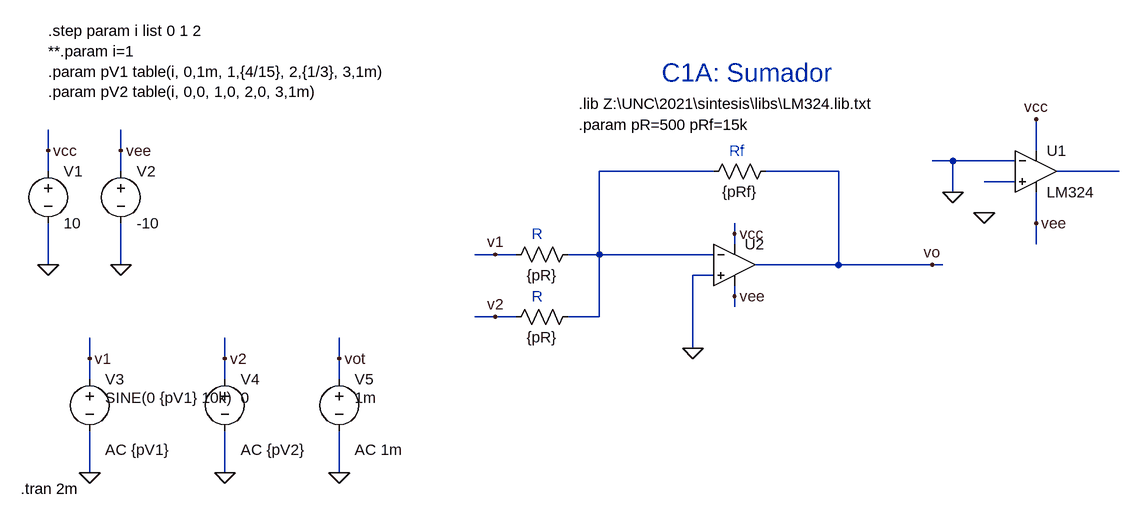
[diagram p0: schematic c1ASumador.asc]
c1ASumador.asc, the LTspice schematic file:
Version 4
SHEET 1 1432 680
WIRE -816 0 -816 -32
WIRE -704 0 -704 -32
WIRE 704 0 704 -48
WIRE 576 16 544 16
WIRE 672 16 576 16
WIRE -816 32 -816 0
WIRE -704 32 -704 0
WIRE 208 32 32 32
WIRE 400 32 288 32
WIRE 832 32 736 32
WIRE 672 48 624 48
WIRE 576 64 576 16
WIRE 704 112 704 64
WIRE 240 128 240 112
WIRE 240 144 240 128
WIRE 704 144 704 112
WIRE -128 160 -160 160
WIRE -96 160 -128 160
WIRE 32 160 32 32
WIRE 32 160 -16 160
WIRE 208 160 32 160
WIRE -816 176 -816 112
WIRE -704 176 -704 112
WIRE 400 176 400 32
WIRE 400 176 272 176
WIRE 544 176 400 176
WIRE 560 176 544 176
WIRE 208 192 176 192
WIRE 240 224 240 208
WIRE 240 240 240 224
WIRE -128 256 -160 256
WIRE -96 256 -128 256
WIRE 32 256 32 160
WIRE 32 256 -16 256
WIRE 176 304 176 192
WIRE -752 320 -752 288
WIRE -544 320 -544 288
WIRE -368 320 -368 288
WIRE -752 352 -752 320
WIRE -544 352 -544 320
WIRE -368 352 -368 320
WIRE -752 496 -752 432
WIRE -544 496 -544 432
WIRE -368 496 -368 432
FLAG 176 304 0
FLAG 240 128 vcc
FLAG 240 224 vee
FLAG -816 176 0
FLAG -816 0 vcc
FLAG -704 176 0
FLAG -704 0 vee
FLAG -752 496 0
FLAG -752 320 v1
FLAG -544 496 0
FLAG -544 320 v2
FLAG 544 176 vo
FLAG -368 496 0
FLAG -368 320 vot
FLAG 704 -48 vcc
FLAG 704 112 vee
FLAG 624 96 0
FLAG -128 160 v1
FLAG 576 64 0
FLAG -128 256 v2
DATAFLAG 496 176 ""
SYMBOL res 0 144 R90
WINDOW 0 0 56 Invisible 2
WINDOW 3 32 56 VTop 2
SYMATTR InstName R1
SYMATTR Value {pR}
SYMBOL voltage -816 16 R0
WINDOW 123 0 0 Left 0
WINDOW 39 0 0 Left 0
SYMATTR InstName V1
SYMATTR Value 10
SYMBOL voltage -704 16 R0
WINDOW 123 0 0 Left 0
WINDOW 39 0 0 Left 0
SYMATTR InstName V2
SYMATTR Value -10
SYMBOL voltage -752 336 R0
WINDOW 123 24 124 Left 2
WINDOW 39 24 44 Left 2
WINDOW 3 24 44 Left 2
SYMATTR Value2 AC {pV1}
SYMATTR Value SINE(0 {pV1} 10k)
SYMATTR InstName V3
SYMBOL voltage -544 336 R0
WINDOW 123 24 124 Left 2
WINDOW 39 0 0 Left 0
WINDOW 3 24 44 Left 2
SYMATTR Value2 AC {pV2}
SYMATTR Value 0
SYMATTR InstName V4
SYMBOL res 0 240 R90
WINDOW 0 0 56 Invisible 2
WINDOW 3 32 56 VTop 2
SYMATTR InstName R2
SYMATTR Value {pR}
SYMBOL res 304 16 R90
WINDOW 0 0 56 Invisible 2
WINDOW 3 32 56 VTop 2
SYMATTR InstName R3
SYMATTR Value {pRf}
SYMBOL OpAmps\\UniversalOpamp2 240 176 R0
SYMATTR InstName U2
SYMATTR Value2 Avol=100k GBW=1Meg Slew=.5Meg
SYMATTR SpiceLine2 en=0 enk=0 in=0 ink=0 Rin=500Meg
SYMBOL voltage -368 336 R0
WINDOW 123 24 124 Left 2
WINDOW 39 24 44 Left 2
WINDOW 3 24 44 Left 2
SYMATTR Value2 AC 1m
SYMATTR Value 1m
SYMATTR InstName V5
SYMBOL OpAmps\\opamp2 704 -32 R0
SYMATTR InstName U1
SYMATTR Value LM324
TEXT 0 -40 Left 2 !.param pR=500 pRf=15k
TEXT 0 -72 Left 2 !.lib Z:\\UNC\\2021\\sintesis\\libs\\LM324.lib.txt
TEXT -816 -184 Left 2 !.step param i list 0 1 2\n**.param i=1\n.param pV1 table(i, 0,1m, 1,{4/15}, 2,{1/3}, 3,1m)\n.param pV2 table(i, 0,0, 1,0, 2,0, 3,1m)
TEXT 128 -120 Left 4 ;C1A: Sumador
TEXT -72 224 Left 2 ;R
TEXT -72 128 Left 2 ;R
TEXT 232 0 Left 2 ;Rf
TEXT -858 520 Left 2 !.tran 2m

The netlist it stands for:
* c1ASumador.asc
R1 N001 v1 {pR}
V1 vcc 0 10
V2 vee 0 -10
V3 v1 0 SINE(0 {pV1} 10k) AC {pV1}
V4 v2 0 0 AC {pV2}
R2 N001 v2 {pR}
R3 vo N001 {pRf}
XU2 0 N001 vcc vee vo level.2 Avol=100k GBW=1Meg Slew=.5Meg ilimit=25m rail=0 Vos=0 phimargin=45 en=0 enk=0 in=0 ink=0 Rin=500Meg  ; pins IN+ IN- V+ V- OUT
V5 vot 0 1m AC 1m
XU1 N003 0 vcc vee N002 LM324  ; pins In+ In- V+ V- OUT
.param pR=500 pRf=15k
.lib Z:\UNC\2021\sintesis\libs\LM324.lib.txt
.step param i list 0 1 2
**.param i=1
.param pV1 table(i, 0,1m, 1,{4/15}, 2,{1/3}, 3,1m)
.param pV2 table(i, 0,0, 1,0, 2,0, 3,1m)
* C1A: Sumador
* R
* R
* Rf
.tran 2m
.lib UniversalOpamps2.sub
.backanno
.end